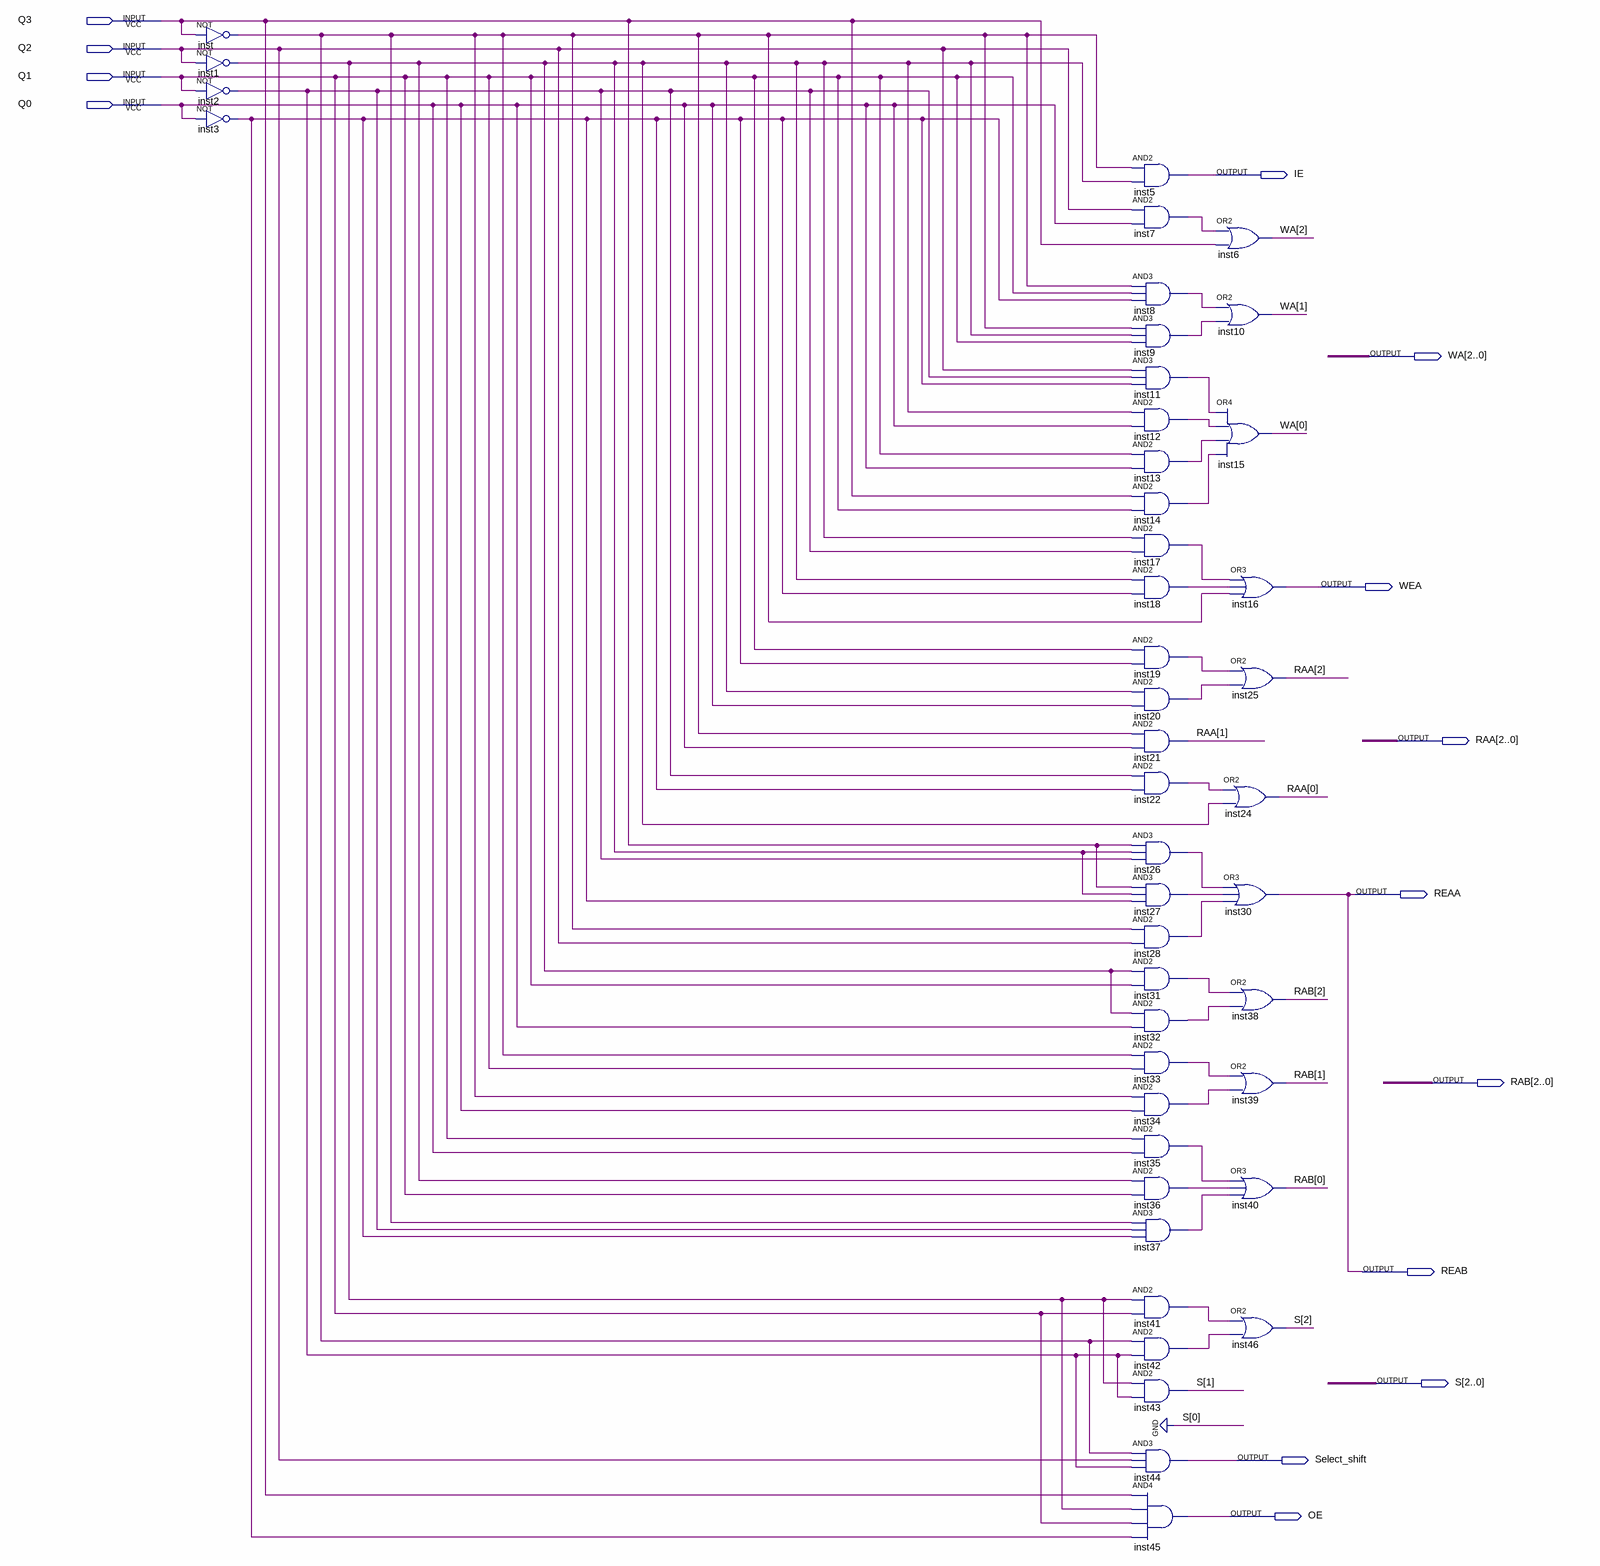
[diagram p0: schematic sheet]
// Quartus schematic Input_Expressions_of_the_Datapath.bdf as structural Verilog: 44 symbols, 14 pins
module Input_Expressions_of_the_Datapath (
  input  Q3,
  input  Q2,
  input  Q1,
  input  Q0,
  output IE,
  output [2:0] WA,
  output WEA,
  output [2:0] RAA,
  output REAA,
  output [2:0] RAB,
  output REAB,
  output [2:0] S,
  output Select_shift,
  output OE
);

  wire inst1_out, inst2_out, inst3_out, inst7_out, inst8_out, inst9_out, inst11_out, inst12_out, inst13_out,
       inst14_out, inst17_out, inst18_out, inst19_out, inst20_out, inst22_out, inst26_out, inst27_out,
       inst28_out, inst31_out, inst32_out, inst33_out, inst34_out, inst35_out, inst36_out, inst37_out,
       inst41_out, inst42_out, inst_out;

  not inst (inst_out, Q3);
  not inst1 (inst1_out, Q2);
  not inst2 (inst2_out, Q1);
  not inst3 (inst3_out, Q0);
  and inst5 (IE, inst_out, inst1_out);
  and inst7 (inst7_out, Q2, Q0);
  and inst8 (inst8_out, inst_out, Q1, inst3_out);
  and inst9 (inst9_out, inst_out, inst1_out, Q1);
  and inst11 (inst11_out, Q2, inst2_out, inst3_out);
  and inst12 (inst12_out, inst1_out, Q0);
  and inst13 (inst13_out, Q1, Q0);
  and inst14 (inst14_out, Q3, Q1);
  and inst17 (inst17_out, inst1_out, inst2_out);
  and inst18 (inst18_out, inst1_out, inst3_out);
  and inst19 (inst19_out, Q1, inst3_out);
  and inst20 (inst20_out, inst1_out, Q0);
  and inst21 (RAA[1], inst_out, Q0);
  and inst22 (inst22_out, inst2_out, inst3_out);
  and inst26 (inst26_out, Q3, inst1_out, inst2_out);
  and inst27 (inst27_out, Q3, inst1_out, inst3_out);
  and inst28 (inst28_out, inst_out, Q2);
  and inst31 (inst31_out, inst1_out, Q1);
  and inst32 (inst32_out, inst1_out, Q0);
  and inst33 (inst33_out, inst_out, Q1);
  and inst34 (inst34_out, inst_out, Q0);
  and inst35 (inst35_out, Q1, Q0);
  and inst36 (inst36_out, inst1_out, Q1);
  and inst37 (inst37_out, inst_out, inst2_out, inst3_out);
  and inst41 (inst41_out, inst1_out, Q1);
  and inst42 (inst42_out, inst_out, inst2_out);
  and inst43 (S[1], inst1_out, inst2_out);
  and inst44 (Select_shift, inst_out, Q2, inst2_out);
  and inst45 (OE, Q3, inst1_out, Q1, inst3_out);
  or inst6 (WA[2], inst7_out, Q3);
  or inst10 (WA[1], inst8_out, inst9_out);
  or inst15 (WA[0], inst11_out, inst12_out, inst13_out, inst14_out);
  or inst16 (WEA, inst17_out, inst18_out, inst_out);
  or inst25 (RAA[2], inst19_out, inst20_out);
  or inst24 (RAA[0], inst22_out, inst1_out);
  or inst30 (REAA, inst26_out, inst27_out, inst28_out);
  or inst38 (RAB[2], inst31_out, inst32_out);
  or inst39 (RAB[1], inst33_out, inst34_out);
  or inst40 (RAB[0], inst35_out, inst36_out, inst37_out);
  or inst46 (S[2], inst41_out, inst42_out);

  assign REAB = REAA;
  assign S[0] = 1'b0;
endmodule
